# Altium schematic sheet MCU.SchDoc
size A4
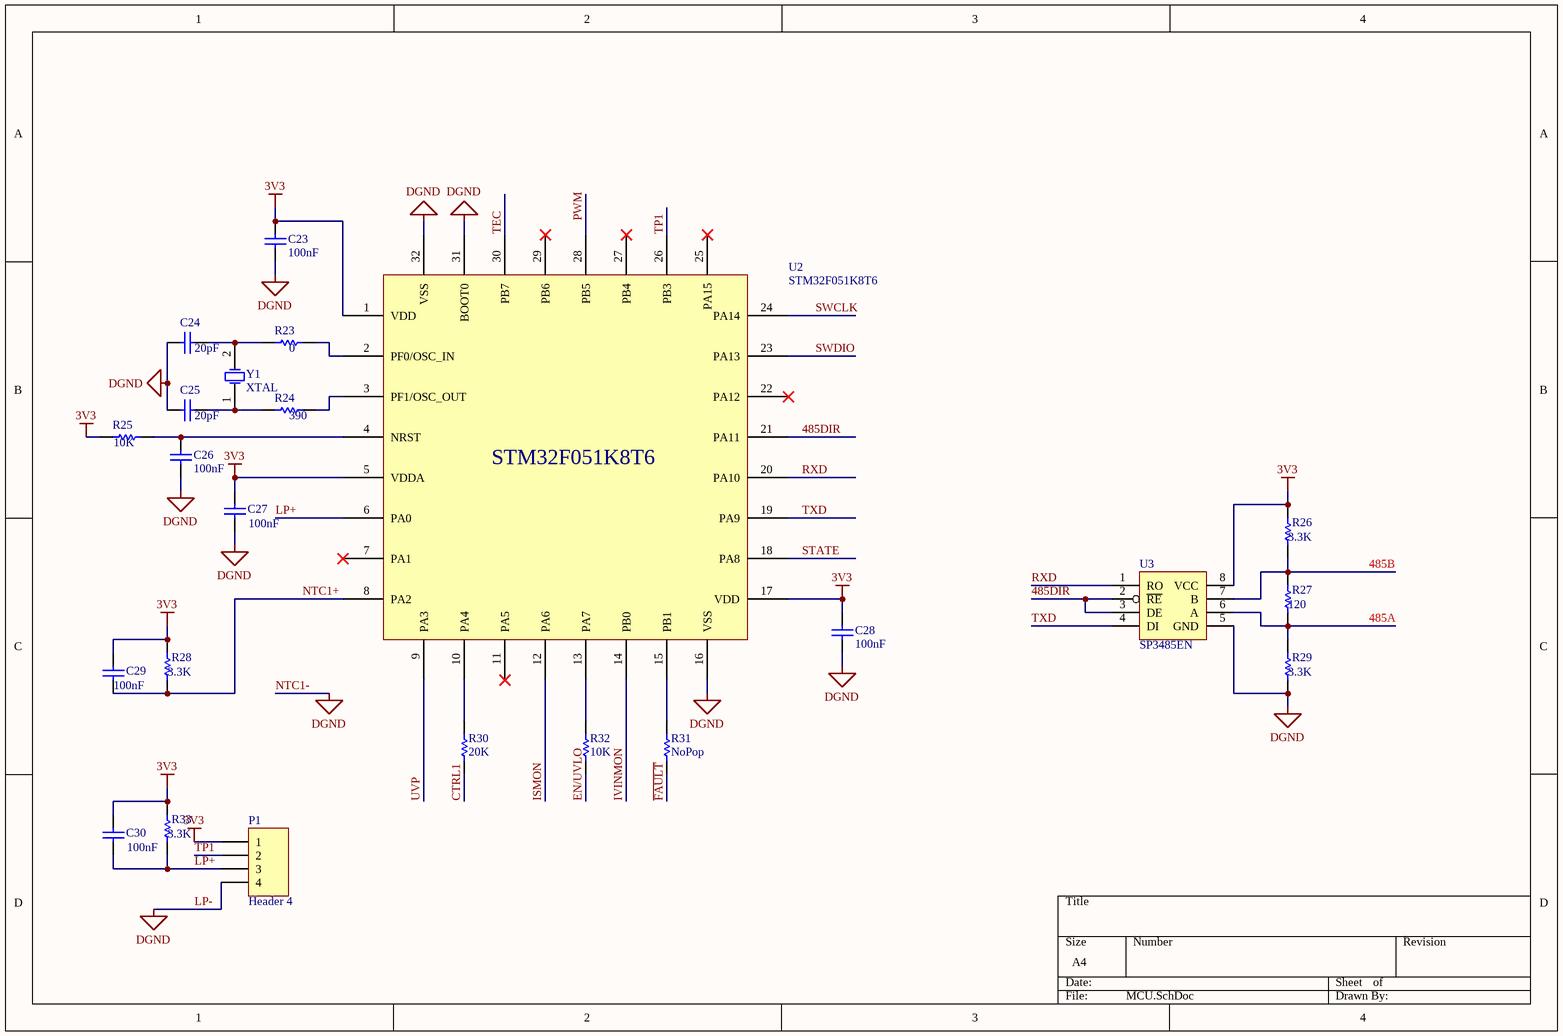
[diagram p0: MCU.SchDoc]

## Parts
C23  100nF  [1608[0603]]
C24  20pF  [1608[0603]]
C25  20pF  [1608[0603]]
C26  100nF  [1608[0603]]
C27  100nF  [1608[0603]]
C28  100nF  [1608[0603]]
C29  100nF  [1608[0603]]
C30  100nF  [1608[0603]]
P1  Header 4  [HDR1X4]
R23  0  [1608[0603]]
R24  390  [1608[0603]]
R25  10K  [1608[0603]]
R26  3.3K  [1608[0603]]
R27  120  [1608[0603]]
R28  3.3K  [1608[0603]]
R29  3.3K  [1608[0603]]
R30  20K  [1608[0603]]
R31  NoPop  [1608[0603]]
R32  10K  [1608[0603]]
R33  3.3K  [1608[0603]]
U2  STM32F051K8T6  [TQFP80P900X900X160-32N]
U3  SP3485EN  [SOIC127P600-8N]
Y1  XTAL  [XTAL_SMT]

## Nets
3V3: C23.2 C27.1 C28.2 C29.1 C30.1 P1.1 R25.2 R26.2 R28.1 R33.1 U2.1(VDD) U2.5(VDDA) U2.17(VDD) U3.8(VCC)
LP-: C23.1 C24.2 C25.2 C26.1 C27.2 C28.1 P1.4 R29.1 U2.16(VSS) U2.31(BOOT0) U2.32(VSS) U3.5(GND)  [also labelled DGND, NTC1-]
485A: R27.1 R29.2 U3.6(A)
485B: R26.1 R27.2 U3.7(B)
485DIR: U2.21(PA11) U3.2(~{RE}) U3.3(DE)
CTRL1: R30.1
EN/UVLO: R32.1
~{FAULT}: R31.1
ISMON: U2.12(PA6)
IVINMON: U2.14(PB0)
LP+: C30.2 P1.3 R33.2 U2.6(PA0)
NTC1+: C29.2 R28.2 U2.8(PA2)
PWM: U2.28(PB5)
RXD: U2.20(PA10) U3.1(RO)
STATE: U2.18(PA8)
SWCLK: U2.24(PA14)
SWDIO: U2.23(PA13)
TEC: U2.30(PB7)
TP1: P1.2 U2.26(PB3)
TXD: U2.19(PA9) U3.4(DI)
UVP: U2.9(PA3)
NetC24_1: C24.1 R23.1 Y1.2(OSC2)
NetC25_1: C25.1 R24.1 Y1.1(OSC1)
NetC26_2: C26.2 R25.1 U2.4(NRST)
NetR23_2: R23.2 U2.2(PF0/OSC_IN)
NetR24_2: R24.2 U2.3(PF1/OSC_OUT)
NetR30_2: R30.2 U2.10(PA4)
NetR31_2: R31.2 U2.15(PB1)
NetR32_2: R32.2 U2.13(PA7)

Not connected (* = marked no-connect by the designer): U2 7(PA1)* 11(PA5)* 22(PA12)* 25(PA15)* 27(PB4)* 29(PB6)*

## Library data of the parts
C23-C30 = Cap: Capacitor; Published: 8-Jun-2000; LatestRevisionDate: 17-Jul-2002; LatestRevisionNote: Re-released for DXP Platform.; PackageReference: RAD-0.3; Publisher: Altium Limited; PackageDescription: Radial Cap, Thru-Hole; 2 Leads; 0.3 in Pin Spacing
  C23 C26-C30: Value: 100nF
  C24 C25: Value: 20pF
P1 = Header 4: Header, 4-Pin; LatestRevisionDate: 17-Jul-2002; LatestRevisionNote: Re-released for DXP Platform.; Publisher: Altium Limited
R23-R30 R32 R33 = Res1: Resistor; Published: 8-Jun-2000; LatestRevisionDate: 17-Jul-2002; LatestRevisionNote: Re-released for DXP Platform.; PackageReference: AXIAL-0.3; Publisher: Altium Limited; PackageDescription: Axial Device, Thru-Hole; 2 Leads; 0.3 in Pin Spacing
  R23: Value: 0
  R24: Value: 390
  R25 R32: Value: 10K
  R26 R28 R29 R33: Value: 3.3K
  R27: Value: 120
  R30: Value: 20k
R31 = Res1: Resistor; Value: 0; Published: 8-Jun-2000; LatestRevisionDate: 17-Jul-2002; LatestRevisionNote: Re-released for DXP Platform.; PackageReference: AXIAL-0.3; Publisher: Altium Limited; PackageDescription: Axial Device, Thru-Hole; 2 Leads; 0.3 in Pin Spacing
U2 = MCU_STM32F051K8T6: Low- and medium-density advanced ARM?-based 32-bit MCU with  16 to 64 Kbytes Flash, timers, ADC, DAC and comm. interfaces
U3 = LGC_RS485: Low-Power, Slew-Rate-Limited  RS-485/RS-422 Transceivers
Y1 = XTAL: Crystal Oscillator; Published: 8-Jun-2000; LatestRevisionDate: 17-Jul-2002; LatestRevisionNote: Re-released for DXP Platform.; PackageReference: R38; Publisher: Altium Limited; PackageDescription: Crystal, Thru-Hole; 2 Leads; Body 3.1 x 8.2 mm (Dia.xH)